# Altium project MB1075.PrjPCB
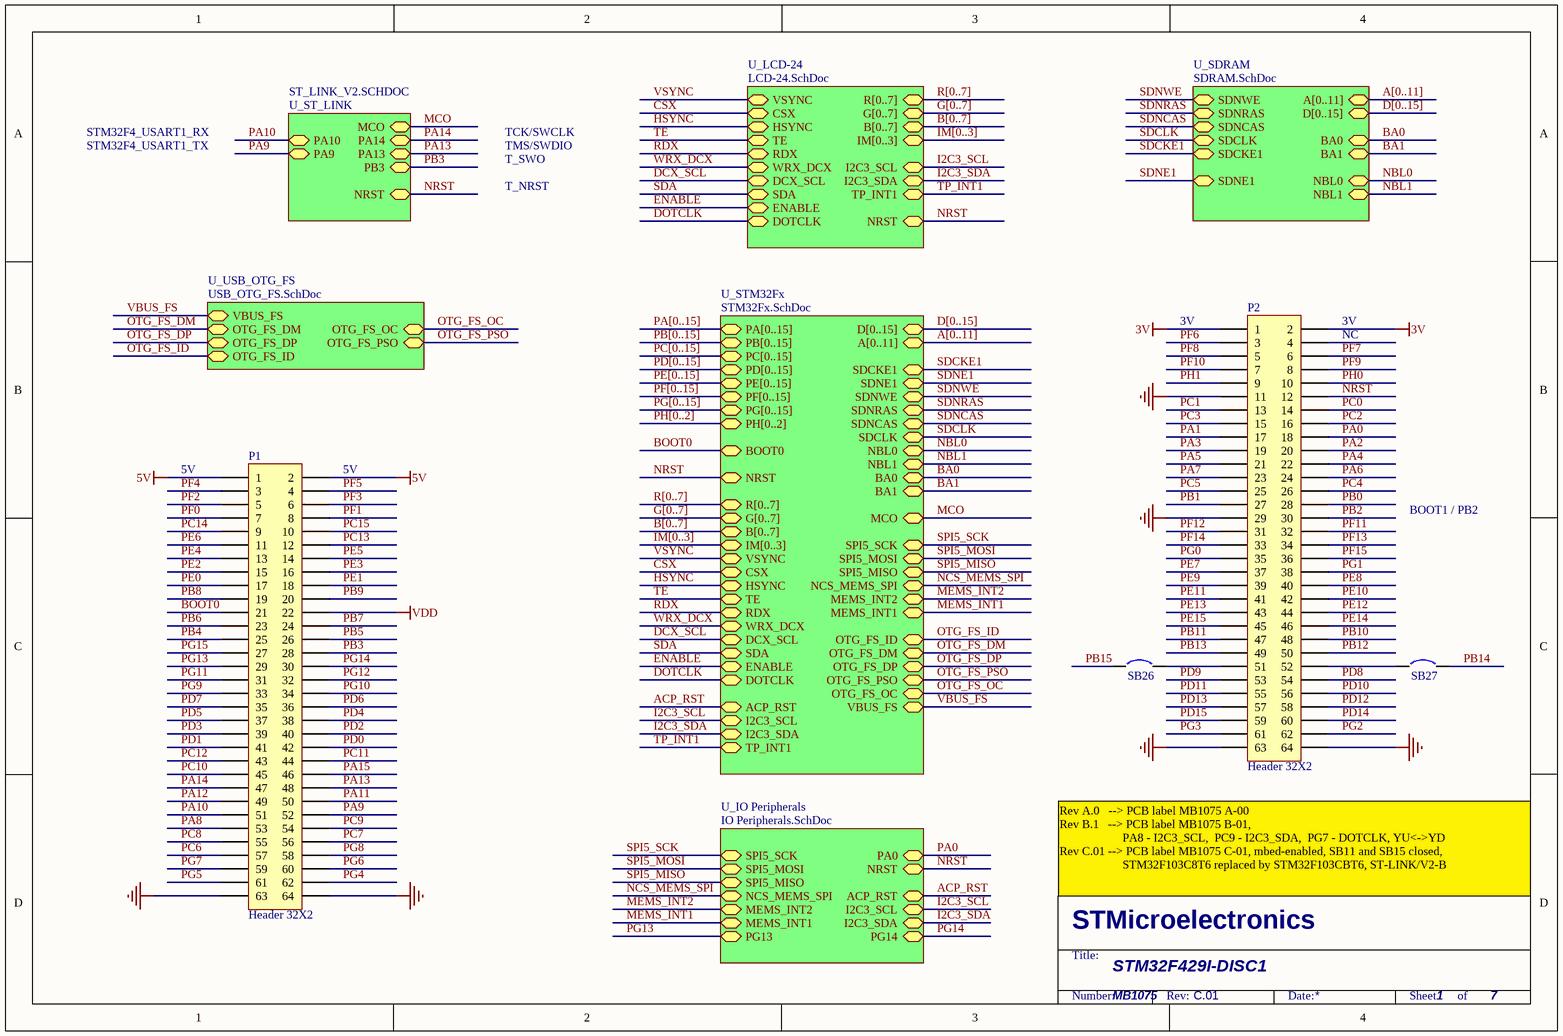
[diagram p0: MB1075.SchDoc]
6 sheets, 158 parts. Net scope: hierarchical (ports join the sheet entries above them; power ports are global).
Sheets:
  MB1075.SchDoc
    U_SDRAM = SDRAM.SchDoc
    U_IO Peripherals = IO Peripherals.SchDoc
    U_STM32Fx = STM32Fx.SchDoc
    U_USB_OTG_FS = USB_OTG_FS.SchDoc
    U_ST_LINK = ST_LINK_V2.SCHDOC

## Sheet MB1075.SchDoc
size A4; DocumentNumber: 1; Revision: C.01; SheetNumber: 1; SheetTotal: 7

### Parts
P1  Header 32X2  [HDR2X32]
P2  Header 32X2  [HDR2X32]
SB26  Circuit Breaker  [JP2_SMD]  (value not drawn)
SB27  Circuit Breaker  [JP2_SMD]  (value not drawn)

### Sub-sheets
U_IO Peripherals = IO Peripherals.SchDoc: PA0, NRST, MEMS_INT1, NCS_MEMS_SPI, MEMS_INT2, SPI5_SCK, SPI5_MISO, SPI5_MOSI, ACP_RST, I2C3_SCL, I2C3_SDA, PG13, PG14
U_LCD-24 = LCD-24.SchDoc (file not in this document): NRST, B[0..7], G[0..7], R[0..7], IM[0..3], TP_INT1, VSYNC, CSX, HSYNC, TE, WRX_DCX, RDX, ENABLE, DCX_SCL, SDA, I2C3_SCL, I2C3_SDA, DOTCLK
U_SDRAM = SDRAM.SchDoc: A[0..11], D[0..15], SDNE1, NBL1, NBL0, SDNWE, SDNRAS, SDNCAS, SDCLK, SDCKE1, BA0, BA1
U_ST_LINK = ST_LINK_V2.SCHDOC: PA13, PA14, NRST, PB3, MCO, PA10, PA9
U_STM32Fx = STM32Fx.SchDoc: BOOT0, NRST, MCO, D[0..15], A[0..11], SDCKE1, SDNE1, SDNWE, NBL0, SDNRAS, NBL1, SDCLK, SDNCAS, BA0, BA1, PA[0..15], PB[0..15], PC[0..15], PD[0..15], PE[0..15], PH[0..2], PF[0..15], PG[0..15], R[0..7], G[0..7], B[0..7], IM[0..3], TP_INT1, VSYNC, CSX, HSYNC, TE, WRX_DCX, RDX, ENABLE, DCX_SCL, SDA, I2C3_SCL, I2C3_SDA, ACP_RST, MEMS_INT1, NCS_MEMS_SPI, MEMS_INT2, SPI5_SCK, SPI5_MISO, SPI5_MOSI, OTG_FS_ID, OTG_FS_DM, OTG_FS_DP, OTG_FS_PSO, OTG_FS_OC, VBUS_FS, DOTCLK
U_USB_OTG_FS = USB_OTG_FS.SchDoc: OTG_FS_PSO, OTG_FS_OC, OTG_FS_DM, OTG_FS_DP, OTG_FS_ID, VBUS_FS

### Nets
3V: P2.1 P2.2
5V: P1.1 P1.2
GND: P1.63 P1.64 P2.11 P2.29 P2.63 P2.64
VDD: P1.22
ACP_RST: P2.23 ; sheet U_IO Peripherals/ACP_RST, sheet U_STM32Fx/ACP_RST  [also labelled PA7]
BA0: P1.62 ; sheet U_SDRAM/BA0, sheet U_STM32Fx/BA0  [also labelled PG4]
BA1: P1.61 ; sheet U_SDRAM/BA1, sheet U_STM32Fx/BA1  [also labelled PG5]
BOOT0: P1.21 ; sheet U_STM32Fx/BOOT0
CSX: P2.16 ; sheet U_STM32Fx/CSX, sheet U_LCD-24/CSX  [also labelled PC2]
DCX_SCL: P2.6 ; sheet U_IO Peripherals/SPI5_SCK, sheet U_STM32Fx/DCX_SCL, sheet U_STM32Fx/SPI5_SCK, sheet U_LCD-24/DCX_SCL  [also labelled PF7, SPI5_SCK]
DOTCLK: P1.59 ; sheet U_STM32Fx/DOTCLK, sheet U_LCD-24/DOTCLK  [also labelled PG7]
ENABLE: P2.7 ; sheet U_STM32Fx/ENABLE, sheet U_LCD-24/ENABLE  [also labelled PF10]
HSYNC: P1.57 ; sheet U_STM32Fx/HSYNC, sheet U_LCD-24/HSYNC  [also labelled PC6]
I2C3_SCL: P1.53 ; sheet U_IO Peripherals/I2C3_SCL, sheet U_STM32Fx/I2C3_SCL, sheet U_LCD-24/I2C3_SCL  [also labelled PA8]
I2C3_SDA: P1.54 ; sheet U_IO Peripherals/I2C3_SDA, sheet U_STM32Fx/I2C3_SDA, sheet U_LCD-24/I2C3_SDA  [also labelled PC9]
MCO: sheet U_STM32Fx/MCO, sheet U_ST_LINK/MCO
MEMS_INT1: P2.17 ; sheet U_IO Peripherals/MEMS_INT1, sheet U_STM32Fx/MEMS_INT1  [also labelled PA1]
MEMS_INT2: P2.20 ; sheet U_IO Peripherals/MEMS_INT2, sheet U_STM32Fx/MEMS_INT2  [also labelled PA2]
NBL0: P1.17 ; sheet U_SDRAM/NBL0, sheet U_STM32Fx/NBL0  [also labelled PE0]
NBL1: P1.18 ; sheet U_SDRAM/NBL1, sheet U_STM32Fx/NBL1  [also labelled PE1]
NCS_MEMS_SPI: P2.13 ; sheet U_IO Peripherals/NCS_MEMS_SPI, sheet U_STM32Fx/NCS_MEMS_SPI  [also labelled PC1]
NRST: P2.12 ; sheet U_IO Peripherals/NRST, sheet U_STM32Fx/NRST, sheet U_ST_LINK/NRST, sheet U_LCD-24/NRST
OTG_FS_DM: SB27.2 ; sheet U_STM32Fx/OTG_FS_DM, sheet U_USB_OTG_FS/OTG_FS_DM  [also labelled PB14]
OTG_FS_DP: SB26.1 ; sheet U_STM32Fx/OTG_FS_DP, sheet U_USB_OTG_FS/OTG_FS_DP  [also labelled PB15]
OTG_FS_ID: P2.50 ; sheet U_STM32Fx/OTG_FS_ID, sheet U_USB_OTG_FS/OTG_FS_ID  [also labelled PB12]
OTG_FS_OC: P2.25 ; sheet U_STM32Fx/OTG_FS_OC, sheet U_USB_OTG_FS/OTG_FS_OC  [also labelled PC5]
OTG_FS_PSO: P2.26 ; sheet U_STM32Fx/OTG_FS_PSO, sheet U_USB_OTG_FS/OTG_FS_PSO  [also labelled PC4]
PA0: P2.18 ; sheet U_IO Peripherals/PA0
PA3: P2.19  [project net B5]
PA4: P2.22 ; sheet U_STM32Fx/VSYNC, sheet U_LCD-24/VSYNC  [also labelled VSYNC]
PA5: P2.21
PA6: P2.24  [project net G2]
PA9: P1.52 ; sheet U_ST_LINK/PA9
PA10: P1.51 ; sheet U_ST_LINK/PA10
PA11: P1.50
PA12: P1.49
PA13: P1.48 ; sheet U_ST_LINK/PA13
PA14: P1.47 ; sheet U_ST_LINK/PA14
PA15: P1.46 ; sheet U_STM32Fx/TP_INT1, sheet U_LCD-24/TP_INT1  [also labelled TP_INT1]
PB0: P2.28
PB1: P2.27
PB2: P2.30
PB3: P1.28 ; sheet U_ST_LINK/PB3
PB4: P1.25
PB5: P1.26 ; sheet U_SDRAM/SDCKE1, sheet U_STM32Fx/SDCKE1  [also labelled SDCKE1]
PB6: P1.23 ; sheet U_SDRAM/SDNE1, sheet U_STM32Fx/SDNE1  [also labelled SDNE1]
PB7: P1.24
PB8: P1.19  [project net B6]
PB9: P1.20  [project net B7]
PB10: P2.48  [project net G4]
PB11: P2.47  [project net G5]
PB13: P2.49 ; sheet U_STM32Fx/VBUS_FS, sheet U_USB_OTG_FS/VBUS_FS  [also labelled VBUS_FS]
PC0: P2.14 ; sheet U_SDRAM/SDNWE, sheet U_STM32Fx/SDNWE  [also labelled SDNWE]
PC3: P2.15
PC7: P1.56  [project net G6]
PC8: P1.55
PC10: P1.45
PC11: P1.44
PC12: P1.43
PC13: P1.12
PC14: P1.9
PC15: P1.10
PD0: P1.42  [project net D2]
PD1: P1.41  [project net D3]
PD2: P1.40
PD3: P1.39  [project net G7]
PD4: P1.38
PD5: P1.37
PD6: P1.36  [project net B2]
PD7: P1.35
PD8: P2.54  [project net D13]
PD9: P2.53  [project net D14]
PD10: P2.56  [project net D15]
PD11: P2.55 ; sheet U_STM32Fx/TE, sheet U_LCD-24/TE  [also labelled TE]
PD12: P2.58 ; sheet U_STM32Fx/RDX, sheet U_LCD-24/RDX  [also labelled RDX]
PD13: P2.57 ; sheet U_STM32Fx/WRX_DCX, sheet U_LCD-24/WRX_DCX  [also labelled WRX_DCX]
PD14: P2.60  [project net D0]
PD15: P2.59  [project net D1]
PE2: P1.15
PE3: P1.16
PE4: P1.13
PE5: P1.14
PE6: P1.11
PE7: P2.37  [project net D4]
PE8: P2.40  [project net D5]
PE9: P2.39  [project net D6]
PE10: P2.42  [project net D7]
PE11: P2.41  [project net D8]
PE12: P2.44  [project net D9]
PE13: P2.43  [project net D10]
PE14: P2.46  [project net D11]
PE15: P2.45  [project net D12]
PF0: P1.7  [project net A0]
PF1: P1.8  [project net A1]
PF2: P1.5  [project net A2]
PF3: P1.6  [project net A3]
PF4: P1.3  [project net A4]
PF5: P1.4  [project net A5]
PF6: P2.3
PF8: P2.5 ; sheet U_IO Peripherals/SPI5_MISO, sheet U_STM32Fx/SPI5_MISO  [also labelled SPI5_MISO]
PF9: P2.8 ; sheet U_IO Peripherals/SPI5_MOSI, sheet U_STM32Fx/SDA, sheet U_STM32Fx/SPI5_MOSI, sheet U_LCD-24/SDA  [also labelled SDA, SPI5_MOSI]
PF11: P2.32 ; sheet U_SDRAM/SDNRAS, sheet U_STM32Fx/SDNRAS  [also labelled SDNRAS]
PF12: P2.31  [project net A6]
PF13: P2.34  [project net A7]
PF14: P2.33  [project net A8]
PF15: P2.36  [project net A9]
PG0: P2.35  [project net A10]
PG1: P2.38  [project net A11]
PG2: P2.62
PG3: P2.61
PG6: P1.60
PG8: P1.58 ; sheet U_SDRAM/SDCLK, sheet U_STM32Fx/SDCLK  [also labelled SDCLK]
PG9: P1.33
PG10: P1.34  [project net G3]
PG11: P1.31  [project net B3]
PG12: P1.32  [project net B4]
PG13: P1.29 ; sheet U_IO Peripherals/PG13
PG14: P1.30 ; sheet U_IO Peripherals/PG14
PG15: P1.27 ; sheet U_SDRAM/SDNCAS, sheet U_STM32Fx/SDNCAS  [also labelled SDNCAS]
PH0: P2.10
PH1: P2.9
NetP2_51: P2.51 SB26.2
NetP2_52: P2.52 SB27.1

Not connected (* = marked no-connect by the designer): P2 4

### Buses and harness runs
bus A[0..11] = sheet U_SDRAM/A[0..11]
bus A[0..11] = sheet U_STM32Fx/A[0..11]
bus B[0..7] = sheet U_LCD-24/B[0..7]
bus B[0..7] = sheet U_STM32Fx/B[0..7]
bus D[0..15] = sheet U_SDRAM/D[0..15]
bus D[0..15] = sheet U_STM32Fx/D[0..15]
bus G[0..7] = sheet U_LCD-24/G[0..7]
bus G[0..7] = sheet U_STM32Fx/G[0..7]
bus IM[0..3] = sheet U_LCD-24/IM[0..3]
bus IM[0..3] = sheet U_STM32Fx/IM[0..3]
bus PA[0..15] = sheet U_STM32Fx/PA[0..15]
bus PB[0..15] = sheet U_STM32Fx/PB[0..15]
bus PC[0..15] = sheet U_STM32Fx/PC[0..15]
bus PD[0..15] = sheet U_STM32Fx/PD[0..15]
bus PE[0..15] = sheet U_STM32Fx/PE[0..15]
bus PF[0..15] = sheet U_STM32Fx/PF[0..15]
bus PG[0..15] = sheet U_STM32Fx/PG[0..15]
bus PH[0..2] = sheet U_STM32Fx/PH[0..2]
bus R[0..7] = sheet U_LCD-24/R[0..7]
bus R[0..7] = sheet U_STM32Fx/R[0..7]

### Notes on the sheet
- STM32F4_USART1_TX
- STM32F4_USART1_RX
- TCK/SWCLK
- TMS/SWDIO
- T_SWO
- T_NRST
- 3V
- (near P2) NC
- (near P2) 3V
- 5V
- (near P1) 5V
- BOOT1 / PB2
- Rev A.0   --> PCB label MB1075 A-00
  Rev B.1   --> PCB label MB1075 B-01,
  PA8 - I2C3_SCL,  PC9 - I2C3_SDA,  PG7 - DOTCLK, YU<->YD
  Rev C.01 --> PCB label MB1075 C-01, mbed-enabled, SB11 and SB15 closed,
  STM32F103C8T6 replaced by STM32F103CBT6, ST-LINK/V2-B
- STM32F429I-DISC1
- MB1075
- STMicroelectronics
- Title:
- Number:
- Rev:
- Date:
- Sheet       of

### Library data of the parts
P1 P2 = Header 32X2: Header, 32-Pin, Dual row; LatestRevisionDate: 17-Jul-2002; LatestRevisionNote: Re-released for DXP Platform.; Publisher: Altium Limited
SB26 SB27 = Circuit Breaker: Solder: NO; Published: 24-Mar-1999; Revision: July-2002: Re-released for DXP Platform.; Publisher: Altium Limited

## Sheet SDRAM.SchDoc
size A4; DocumentNumber: 4; Revision: C.01; SheetNumber: 4; SheetTotal: 7
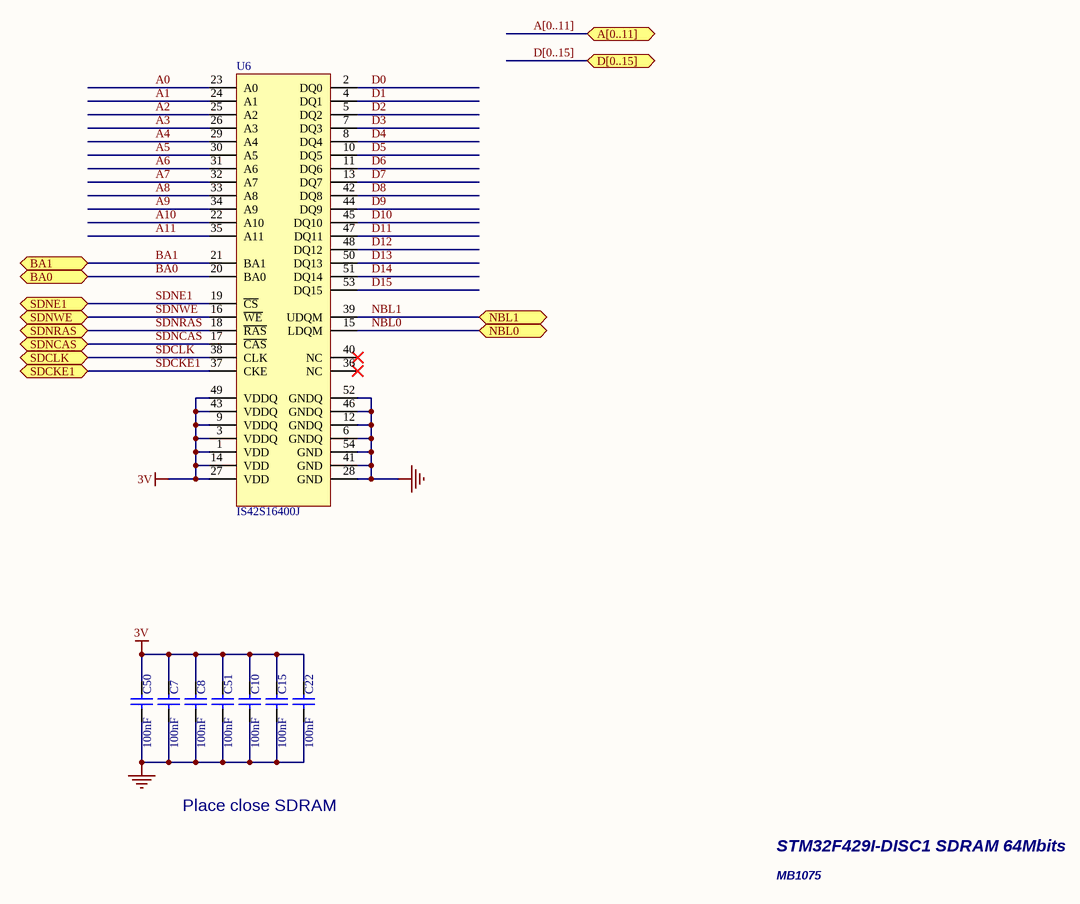
[diagram p1: SDRAM.SchDoc]

### Parts
C7  100nF  [0402C]
C8  100nF  [0402C]
C10  100nF  [0402C]
C15  100nF  [0402C]
C22  100nF  [0402C]
C50  100nF  [0402C]
C51  100nF  [0402C]
U6  IS42S16400J  [TSOP54-II]

### Ports
A[0..11], BA0, BA1, D[0..15], NBL0, NBL1, SDCKE1, SDCLK, SDNCAS, SDNE1, SDNRAS, SDNWE

### Nets
3V: C7.2 C8.2 C10.2 C15.2 C22.2 C50.2 C51.2 U6.1(VDD) U6.3(VDDQ) U6.9(VDDQ) U6.14(VDD) U6.27(VDD) U6.43(VDDQ) U6.49(VDDQ)
GND: C7.1 C8.1 C10.1 C15.1 C22.1 C50.1 C51.1 U6.6(GNDQ) U6.12(GNDQ) U6.28(GND) U6.41(GND) U6.46(GNDQ) U6.52(GNDQ) U6.54(GND)
A0: U6.23(A0)
A1: U6.24(A1)
A2: U6.25(A2)
A3: U6.26(A3)
A4: U6.29(A4)
A5: U6.30(A5)
A6: U6.31(A6)
A7: U6.32(A7)
A8: U6.33(A8)
A9: U6.34(A9)
A10: U6.22(A10)
A11: U6.35(A11)
BA0: U6.20(BA0) ; port BA0
BA1: U6.21(BA1) ; port BA1
D0: U6.2(DQ0)
D1: U6.4(DQ1)
D2: U6.5(DQ2)
D3: U6.7(DQ3)
D4: U6.8(DQ4)
D5: U6.10(DQ5)
D6: U6.11(DQ6)
D7: U6.13(DQ7)
D8: U6.42(DQ8)
D9: U6.44(DQ9)
D10: U6.45(DQ10)
D11: U6.47(DQ11)
D12: U6.48(DQ12)
D13: U6.50(DQ13)
D14: U6.51(DQ14)
D15: U6.53(DQ15)
NBL0: U6.15(LDQM) ; port NBL0
NBL1: U6.39(UDQM) ; port NBL1
SDCKE1: U6.37(CKE) ; port SDCKE1  [project net PB5]
SDCLK: U6.38(CLK) ; port SDCLK  [project net PG8]
SDNCAS: U6.17(~{CAS}) ; port SDNCAS  [project net PG15]
SDNE1: U6.19(~{CS}) ; port SDNE1  [project net PB6]
SDNRAS: U6.18(~{RAS}) ; port SDNRAS  [project net PF11]
SDNWE: U6.16(~{WE}) ; port SDNWE  [project net PC0]

Not connected (* = marked no-connect by the designer): U6 36(NC)* 40(NC)*

### Buses and harness runs
bus A[0..11] = port A[0..11]
bus D[0..15] = port D[0..15]

### Notes on the sheet
- Place close SDRAM
- STM32F429I-DISC1 SDRAM 64Mbits
- MB1075
- STMicroelectronics
- Title:
- Number:
- Rev:
- Date:
- Sheet       of

### Library data of the parts
C7 C8 C10 C15 C22 C50 C51 = Capacitor_ST: Capacitor 0402 / 0603 / 0805; Revision: July-2002: Re-released for DXP Platform.; Value: 100nF
U6 = IS45S16400J: SYNCHRONOUS DYNAMIC RAM, 1 Meg Bits x 16 Bits x 4 Banks (64-MBIT); Manuf_1: ISSI; Order: IS42S16400J-7TL; ECCN_US/EU: EAR99/NEC; Distrib: *; Manuf_Part_1: IS42S16400J-7TL; Ref St: *

## Sheet IO Peripherals.SchDoc
size A4; DocumentNumber: 6; Revision: C.01; SheetNumber: 6; SheetTotal: 7
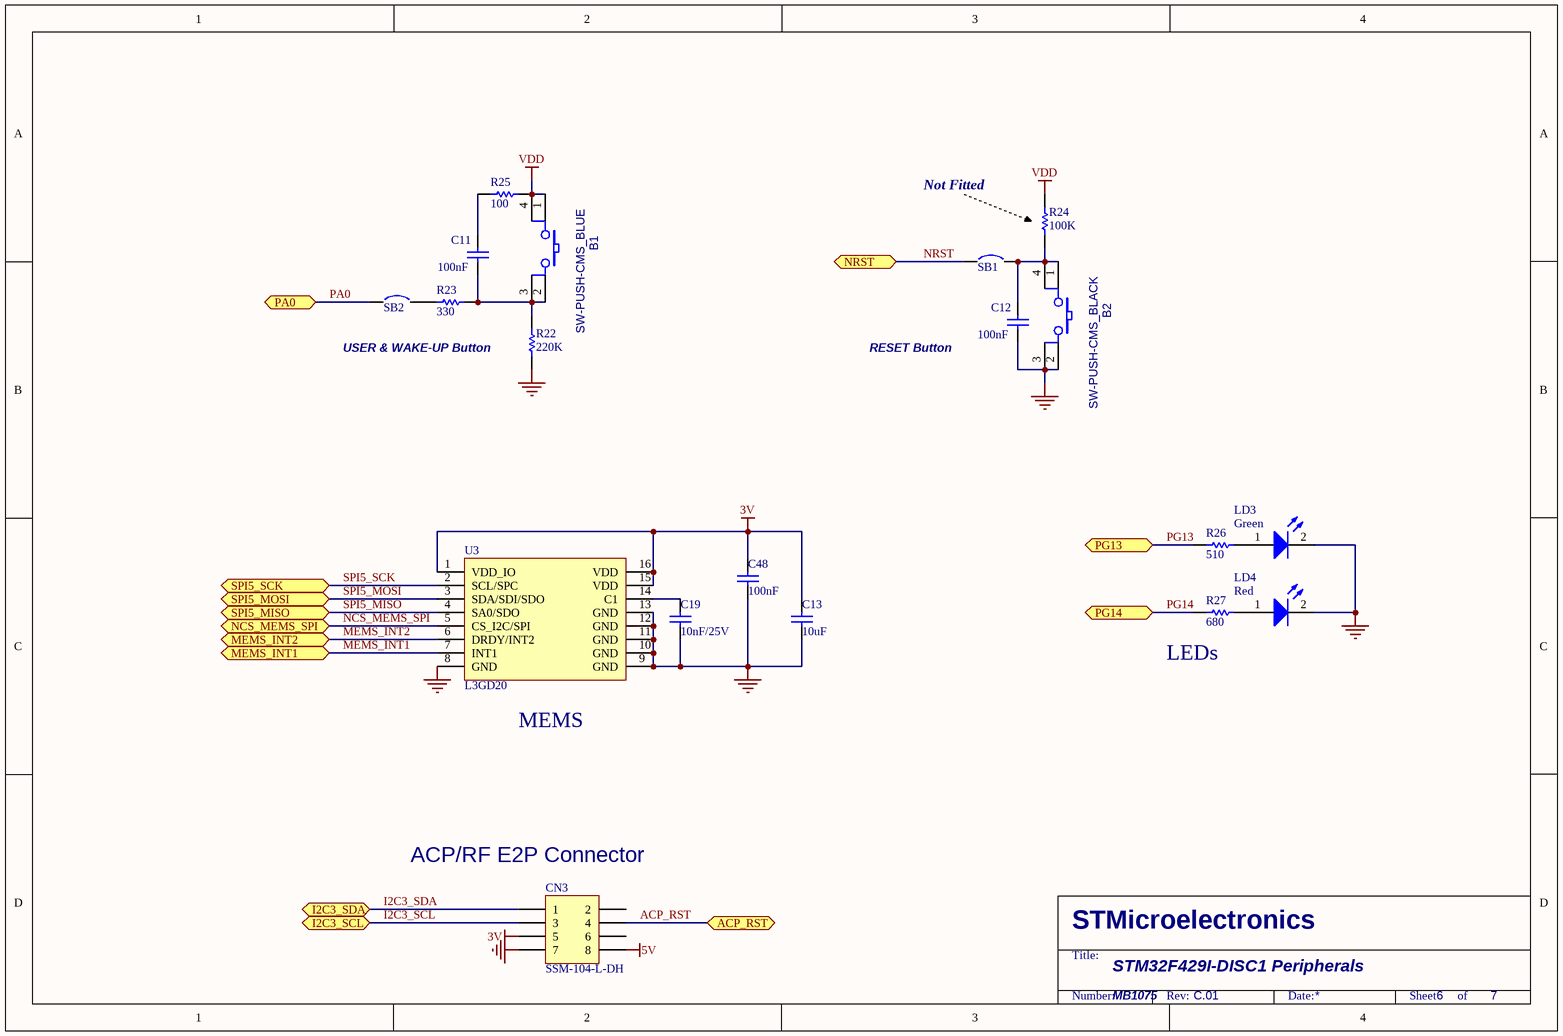
[diagram p2: IO Peripherals.SchDoc]

### Parts
B1  SW-PUSH-CMS_BLUE  [BP1CMS]
B2  SW-PUSH-CMS_BLACK  [BP1CMS]
C11  100nF  [0402C]
C12  100nF  [0402C]
C13  10uF  [0603C]
C19  10nF/25V  [0603C]
C48  100nF  [0402C]
CN3  SSM-104-L-DH  [SSM-104-L-DH]
LD3  Green  [0603D]
LD4  Red  [0603D]
R22  220K  [0402R]
R23  330  [0402R]
R24  100K  [0402R]
R25  100  [0402R]
R26  510  [0603R]
R27  680  [0603R]
SB1  Circuit Breaker  [JP2_SMD]  (value not drawn)
SB2  Circuit Breaker  [JP2_SMD]  (value not drawn)
U3  L3GD20  [LGA16-4x4]

### Ports
ACP_RST, I2C3_SCL, I2C3_SDA, MEMS_INT1, MEMS_INT2, NCS_MEMS_SPI, NRST, PA0, PG13, PG14, SPI5_MISO, SPI5_MOSI, SPI5_SCK

### Nets
3V: C13.2 C48.2 CN3.5 U3.1(VDD_IO) U3.15(VDD) U3.16(VDD)
5V: CN3.8
GND: B2.2 B2.3 C12.1 C13.1 C19.1 C48.1 CN3.7 LD3.2(K) LD4.2(K) R22.1 U3.8(GND) U3.9(GND) U3.10(GND) U3.11(GND) U3.12(GND) U3.13(GND)
VDD: B1.1 B1.4 R24.2 R25.2
ACP_RST: CN3.4 ; port ACP_RST
I2C3_SCL: CN3.3 ; port I2C3_SCL
I2C3_SDA: CN3.1 ; port I2C3_SDA
MEMS_INT1: U3.7(INT1) ; port MEMS_INT1
MEMS_INT2: U3.6(DRDY/INT2) ; port MEMS_INT2
NCS_MEMS_SPI: U3.5(CS_I2C/SPI) ; port NCS_MEMS_SPI
NRST: SB1.1 ; port NRST
PA0: SB2.1 ; port PA0
PG13: R26.1 ; port PG13
PG14: R27.1 ; port PG14
SPI5_MISO: U3.4(SA0/SDO) ; port SPI5_MISO  [project net PF8]
SPI5_MOSI: U3.3(SDA/SDI/SDO) ; port SPI5_MOSI  [project net PF9]
SPI5_SCK: U3.2(SCL/SPC) ; port SPI5_SCK  [project net DCX_SCL]
NetB1_2: B1.2 B1.3 C11.1 R22.2 R23.2
NetB2_1: B2.1 B2.4 C12.2 R24.1 SB1.2
NetC11_2: C11.2 R25.1
NetC19_2: C19.2 U3.14(C1)
NetLD3_1: LD3.1(A) R26.2
NetLD4_1: LD4.1(A) R27.2
NetR23_1: R23.1 SB2.2

Not connected (* = marked no-connect by the designer): CN3 2 6

### Notes on the sheet
- Not Fitted
- USER & WAKE-UP Button
- RESET Button
- (near R27) LEDs
- (near U3) MEMS
- (near CN3) ACP/RF E2P Connector
- STM32F429I-DISC1 Peripherals
- MB1075
- STMicroelectronics
- Title:
- Number:
- Rev:
- Date:
- Sheet       of

### Library data of the parts
B1 = SW-PUSH-CMS_BLUE: Non-Open Push-Button 0.1A 24V; Manuf_2: FARNELL; Manuf_Part_2: 535-930; Manuf_1: wealthmetal; Manuf_Part_1: TD0341X-G01-BLU; Ref St: 9180120; Description: Non-Open Push Button,Blue 0.1A 24V,Square head,6*6,SMT,180Degree,TD-0341X-GO1,wealthmetal; Distrib: *
B2 = SW-PUSH-CMS_BLACK: Non-Open Push-Button 0.1A 24V; Manuf_2: FARNELL; Manuf_Part_2: 535-930; Manuf_1: wealthmetal; Manuf_Part_1: TD0341X-G01-BLA; Ref St: 9180120; Description: Non-Open Push Button,Black 0.1A 24V,Square head,6*6,SMT,180Degree,TD-0341X-GO1,wealthmetal; Distrib: *
C11 C12 C48 = Capacitor_ST: Capacitor 0402 / 0603 / 0805; Revision: July-2002: Re-released for DXP Platform.; Value: 100nF
C13 C19 = CAP: Capacitor; Value: 100nF; Published: 8-Jun-2000; Revision: July-2002: Re-released for DXP Platform.; Publisher: Altium Limited
CN3 = SSM-104-L-DH: Header, 5-Pin, Dual row; Revision: 17-Jul-2002: Re-released for DXP Platform.; Publisher: Altium Limited
LD3 LD4 = LED2: Typical RED, GREEN, YELLOW, AMBER GaAs LED; Published: 8-Jun-2000; Revision: July-2002: Re-released for DXP Platform.; Publisher: Altium Limited
R22-R27 = Resistor_ST: Resistor 0402 / 0603 / 0805; Description: Resistor 0402 or 0603 or 0805; Value: 10K
SB1 SB2 = Circuit Breaker: Solder: YES; Published: 24-Mar-1999; Revision: July-2002: Re-released for DXP Platform.; Publisher: Altium Limited
U3 = L3GD20: MEMS motion sensor three-axis digital output gyroscopeelerometer; Manuf_1: STM; Manuf_Part_1: L3GD20TR; Provided: ST; Ref St: 9177042; ECCN_US/EU: EAR99/NEC; Distrib: ST; Footprint: LGA16(4*4); Order: L3GD20TR

## Sheet STM32Fx.SchDoc
size A4; DocumentNumber: 5; Revision: C.01; SheetNumber: 5; SheetTotal: 7
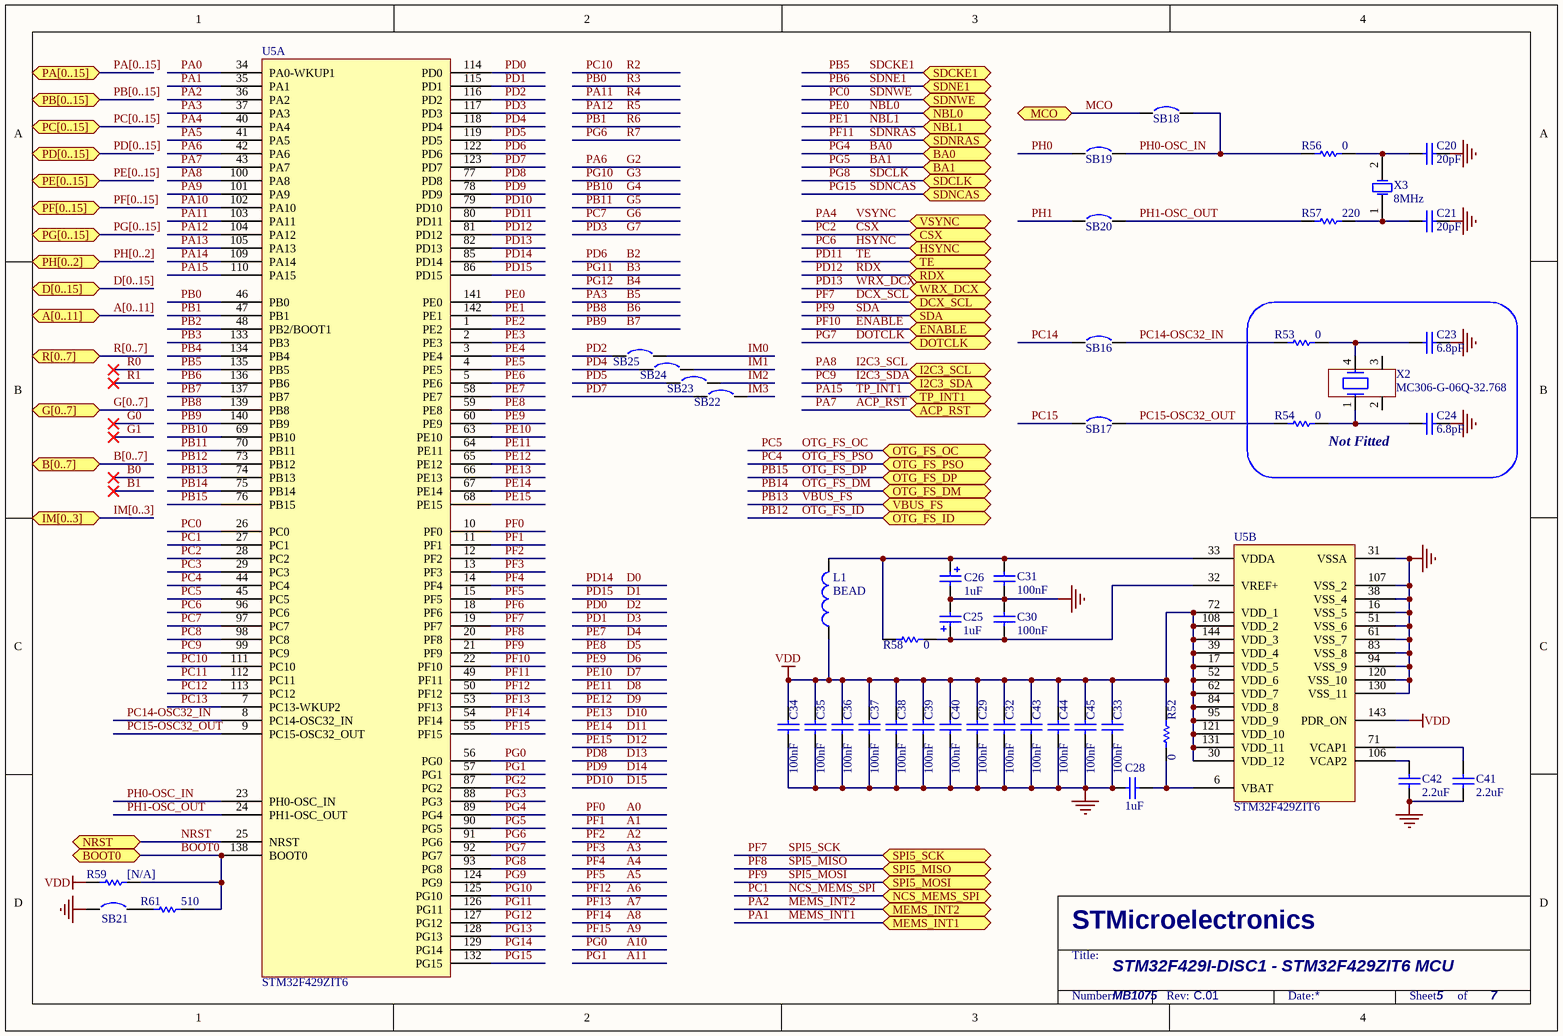
[diagram p3: STM32Fx.SchDoc]

### Parts
C20  20pF  [0402C]
C21  20pF  [0402C]
C23  6.8pF  [0402C]
C24  6.8pF  [0402C]
C25  1uF  [TAN-A]
C26  1uF  [TAN-A]
C28  1uF  [0603C]
C29  100nF  [0402C]
C30  100nF  [0402C]
C31  100nF  [0402C]
C32  100nF  [0402C]
C33  100nF  [0402C]
C34  100nF  [0402C]
C35  100nF  [0402C]
C36  100nF  [0402C]
C37  100nF  [0402C]
C38  100nF  [0402C]
C39  100nF  [0402C]
C40  100nF  [0402C]
C41  2.2uF  [TAN-A]
C42  2.2uF  [TAN-A]
C43  100nF  [0402C]
C44  100nF  [0402C]
C45  100nF  [0402C]
L1  BEAD  [0603L]
R52  0  [0402R]
R53  0  [0402R]
R54  0  [0402R]
R56  0  [0402R]
R57  220  [0402R]
R58  0  [0402R]
R59  [N/A]  [0402R]
R61  510  [0402R]
SB16  Circuit Breaker  [JP2_SMD]  (value not drawn)
SB17  Circuit Breaker  [JP2_SMD]  (value not drawn)
SB18  Circuit Breaker  [JP2_SMD]  (value not drawn)
SB19  Circuit Breaker  [JP2_SMD]  (value not drawn)
SB20  Circuit Breaker  [JP2_SMD]  (value not drawn)
SB21  Circuit Breaker  [JP2_SMD]  (value not drawn)
SB22  Circuit Breaker  [JP2_SMD]  (value not drawn)
SB23  Circuit Breaker  [JP2_SMD]  (value not drawn)
SB24  Circuit Breaker  [JP2_SMD]  (value not drawn)
SB25  Circuit Breaker  [JP2_SMD]  (value not drawn)
U5  STM32F429ZIT6  [TQFP144]  (parts A,B of 2)
X2  MC306-G-06Q-32.768  [MC306-CRYSTAL]
X3  8MHz  [XTAL1]

### Blocks framed on the sheet
Not Fitted: C23 C24 R53 R54 X2

### Ports
A[0..11], ACP_RST, B[0..7], BA0, BA1, BOOT0, CSX, D[0..15], DCX_SCL, DOTCLK, ENABLE, G[0..7], HSYNC, I2C3_SCL, I2C3_SDA, IM[0..3], MCO, MEMS_INT1, MEMS_INT2, NBL0, NBL1, NCS_MEMS_SPI, NRST, OTG_FS_DM, OTG_FS_DP, OTG_FS_ID, OTG_FS_OC, OTG_FS_PSO, PA[0..15], PB[0..15], PC[0..15], PD[0..15], PE[0..15], PF[0..15], PG[0..15], PH[0..2], R[0..7], RDX, SDA, SDCKE1, SDCLK, SDNCAS, SDNE1, SDNRAS, SDNWE, SPI5_MISO, SPI5_MOSI, SPI5_SCK, TE, TP_INT1, VBUS_FS, VSYNC, WRX_DCX

### Nets
GND: C20.2 C21.2 C23.2 C24.2 C25.2 C26.2 C28.1 C29.1 C30.2 C31.1 C32.1 C33.1 C34.1 C35.1 C36.1 C37.1 C38.1 C39.1 C40.1 C41.2 C42.2 C43.1 C44.1 C45.1 SB21.1 U5.16(VSS_5) U5.31(VSSA) U5.38(VSS_4) U5.51(VSS_6) U5.61(VSS_7) U5.83(VSS_8) U5.94(VSS_9) U5.107(VSS_2) U5.120(VSS_10) U5.130(VSS_11)
VDD: C29.2 C32.2 C33.2 C34.2 C35.2 C36.2 C37.2 C38.2 C39.2 C40.2 C43.2 C44.2 C45.2 L1.1 R52.2 R59.1 U5.17(VDD_5) U5.30(VDD_12) U5.39(VDD_4) U5.52(VDD_6) U5.62(VDD_7) U5.72(VDD_1) U5.84(VDD_8) U5.95(VDD_9) U5.108(VDD_2) U5.121(VDD_10) U5.131(VDD_11) U5.143(PDR_ON) U5.144(VDD_3)
A0: U5.10(PF0)  [also labelled PF0]
A1: U5.11(PF1)  [also labelled PF1]
A2: U5.12(PF2)  [also labelled PF2]
A3: U5.13(PF3)  [also labelled PF3]
A4: U5.14(PF4)  [also labelled PF4]
A5: U5.15(PF5)  [also labelled PF5]
A6: U5.50(PF12)  [also labelled PF12]
A7: U5.53(PF13)  [also labelled PF13]
A8: U5.54(PF14)  [also labelled PF14]
A9: U5.55(PF15)  [also labelled PF15]
A10: U5.56(PG0)  [also labelled PG0]
A11: U5.57(PG1)  [also labelled PG1]
ACP_RST: U5.43(PA7) ; port ACP_RST  [also labelled PA7]
B2: U5.122(PD6)  [also labelled PD6]
B3: U5.126(PG11)  [also labelled PG11]
B4: U5.127(PG12)  [also labelled PG12]
B5: U5.37(PA3)  [also labelled PA3]
B6: U5.139(PB8)  [also labelled PB8]
B7: U5.140(PB9)  [also labelled PB9]
BA0: U5.89(PG4) ; port BA0  [also labelled PG4]
BA1: U5.90(PG5) ; port BA1  [also labelled PG5]
BOOT0: R59.2 R61.2 U5.138(BOOT0) ; port BOOT0
CSX: U5.28(PC2) ; port CSX  [also labelled PC2]
D0: U5.85(PD14)  [also labelled PD14]
D1: U5.86(PD15)  [also labelled PD15]
D2: U5.114(PD0)  [also labelled PD0]
D3: U5.115(PD1)  [also labelled PD1]
D4: U5.58(PE7)  [also labelled PE7]
D5: U5.59(PE8)  [also labelled PE8]
D6: U5.60(PE9)  [also labelled PE9]
D7: U5.63(PE10)  [also labelled PE10]
D8: U5.64(PE11)  [also labelled PE11]
D9: U5.65(PE12)  [also labelled PE12]
D10: U5.66(PE13)  [also labelled PE13]
D11: U5.67(PE14)  [also labelled PE14]
D12: U5.68(PE15)  [also labelled PE15]
D13: U5.77(PD8)  [also labelled PD8]
D14: U5.78(PD9)  [also labelled PD9]
D15: U5.79(PD10)  [also labelled PD10]
DCX_SCL: U5.19(PF7) ; port DCX_SCL, port SPI5_SCK  [also labelled PF7, SPI5_SCK]
DOTCLK: U5.92(PG7) ; port DOTCLK  [also labelled PG7]
ENABLE: U5.22(PF10) ; port ENABLE  [also labelled PF10]
G2: U5.42(PA6)  [also labelled PA6]
G3: U5.125(PG10)  [also labelled PG10]
G4: U5.69(PB10)  [also labelled PB10]
G5: U5.70(PB11)  [also labelled PB11]
G6: U5.97(PC7)  [also labelled PC7]
G7: U5.117(PD3)  [also labelled PD3]
HSYNC: U5.96(PC6) ; port HSYNC  [also labelled PC6]
I2C3_SCL: U5.100(PA8) ; port I2C3_SCL  [also labelled PA8]
I2C3_SDA: U5.99(PC9) ; port I2C3_SDA  [also labelled PC9]
IM0: SB25.2
IM1: SB24.2
IM2: SB23.2
IM3: SB22.2
MCO: SB18.1 ; port MCO
MEMS_INT1: U5.35(PA1) ; port MEMS_INT1  [also labelled PA1]
MEMS_INT2: U5.36(PA2) ; port MEMS_INT2  [also labelled PA2]
NBL0: U5.141(PE0) ; port NBL0  [also labelled PE0]
NBL1: U5.142(PE1) ; port NBL1  [also labelled PE1]
NCS_MEMS_SPI: U5.27(PC1) ; port NCS_MEMS_SPI  [also labelled PC1]
NRST: U5.25(NRST) ; port NRST
OTG_FS_DM: U5.75(PB14) ; port OTG_FS_DM  [also labelled PB14]
OTG_FS_DP: U5.76(PB15) ; port OTG_FS_DP  [also labelled PB15]
OTG_FS_ID: U5.73(PB12) ; port OTG_FS_ID  [also labelled PB12]
OTG_FS_OC: U5.45(PC5) ; port OTG_FS_OC  [also labelled PC5]
OTG_FS_PSO: U5.44(PC4) ; port OTG_FS_PSO  [also labelled PC4]
PA0: U5.34(PA0-WKUP1)
PA4: U5.40(PA4) ; port VSYNC  [also labelled VSYNC]
PA5: U5.41(PA5)
PA9: U5.101(PA9)
PA10: U5.102(PA10)
PA11: U5.103(PA11)  [also labelled R4]
PA12: U5.104(PA12)  [also labelled R5]
PA13: U5.105(PA13)
PA14: U5.109(PA14)
PA15: U5.110(PA15) ; port TP_INT1  [also labelled TP_INT1]
PB0: U5.46(PB0)  [also labelled R3]
PB1: U5.47(PB1)  [also labelled R6]
PB2: U5.48(PB2/BOOT1)
PB3: U5.133(PB3)
PB4: U5.134(PB4)
PB5: U5.135(PB5) ; port SDCKE1  [also labelled SDCKE1]
PB6: U5.136(PB6) ; port SDNE1  [also labelled SDNE1]
PB7: U5.137(PB7)
PB13: U5.74(PB13) ; port VBUS_FS  [also labelled VBUS_FS]
PC0: U5.26(PC0) ; port SDNWE  [also labelled SDNWE]
PC3: U5.29(PC3)
PC8: U5.98(PC8)
PC10: U5.111(PC10)  [also labelled R2]
PC11: U5.112(PC11)
PC12: U5.113(PC12)
PC13: U5.7(PC13-WKUP2)
PC14: SB16.1
PC14-OSC32_IN: R53.1 SB16.2 U5.8(PC14-OSC32_IN)
PC15: SB17.1
PC15-OSC32_OUT: R54.1 SB17.2 U5.9(PC15-OSC32_OUT)
PD2: SB25.1 U5.116(PD2)
PD4: SB24.1 U5.118(PD4)
PD5: SB23.1 U5.119(PD5)
PD7: SB22.1 U5.123(PD7)
PD11: U5.80(PD11) ; port TE  [also labelled TE]
PD12: U5.81(PD12) ; port RDX  [also labelled RDX]
PD13: U5.82(PD13) ; port WRX_DCX  [also labelled WRX_DCX]
PE2: U5.1(PE2)
PE3: U5.2(PE3)
PE4: U5.3(PE4)
PE5: U5.4(PE5)
PE6: U5.5(PE6)
PF6: U5.18(PF6)
PF8: U5.20(PF8) ; port SPI5_MISO  [also labelled SPI5_MISO]
PF9: U5.21(PF9) ; port SDA, port SPI5_MOSI  [also labelled SDA, SPI5_MOSI]
PF11: U5.49(PF11) ; port SDNRAS  [also labelled SDNRAS]
PG2: U5.87(PG2)
PG3: U5.88(PG3)
PG6: U5.91(PG6)  [also labelled R7]
PG8: U5.93(PG8) ; port SDCLK  [also labelled SDCLK]
PG9: U5.124(PG9)
PG13: U5.128(PG13)
PG14: U5.129(PG14)
PG15: U5.132(PG15) ; port SDNCAS  [also labelled SDNCAS]
PH0: SB19.1
PH0-OSC_IN: R56.1 SB18.2 SB19.2 U5.23(PH0-OSC_IN)
PH1: SB20.1
PH1-OSC_OUT: R57.1 SB20.2 U5.24(PH1-OSC_OUT)
NetC20_1: C20.1 R56.2 X3.2(OSC2)
NetC21_1: C21.1 R57.2 X3.1(OSC1)
NetC23_1: C23.1 R53.2 X2.4
NetC24_1: C24.1 R54.2 X2.1
NetC25_1: C25.1 C30.1 R58.2 U5.32(VREF+)
NetC26_1: C26.1 C31.2 L1.2 R58.1 U5.33(VDDA)
NetC28_2: C28.2 R52.1 U5.6(VBAT)
NetC41_1: C41.1 U5.71(VCAP1)
NetC42_1: C42.1 U5.106(VCAP2)
NetR61_1: R61.1 SB21.2

Not connected (* = marked no-connect by the designer): X2 2 3

### Buses and harness runs
bus A[0..11] = port A[0..11]
bus B[0..7] = port B[0..7]
bus D[0..15] = port D[0..15]
bus G[0..7] = port G[0..7]
bus IM[0..3] = port IM[0..3]
bus PA[0..15] = port PA[0..15]
bus PB[0..15] = port PB[0..15]
bus PC[0..15] = port PC[0..15]
bus PD[0..15] = port PD[0..15]
bus PE[0..15] = port PE[0..15]
bus PF[0..15] = port PF[0..15]
bus PG[0..15] = port PG[0..15]
bus PH[0..2] = port PH[0..2]
bus R[0..7] = port R[0..7]

### Notes on the sheet
- STM32F429I-DISC1 - STM32F429ZIT6 MCU
- MB1075
- STMicroelectronics
- Title:
- Number:
- Rev:
- Date:
- Sheet       of

### Library data of the parts
C20 C21 C28 = Capacitor_ST: Capacitor 0402 / 0603 / 0805; Value: 100nF; Revision: July-2002: Re-released for DXP Platform.
C23 C24 = Capacitor_ST: Capacitor 0402 / 0603 / 0805; Value: 100nF; Fitted: NO; Revision: July-2002: Re-released for DXP Platform.
C25 C26 = Cap Pol1: Polarized Capacitor (Radial); Value: 10uF; Published: 8-Jun-2000; Revision: July-2002: Re-released for DXP Platform.; Publisher: Altium Limited
C29-C40 C43-C45 = Capacitor_ST: Capacitor 0402 / 0603 / 0805; Revision: July-2002: Re-released for DXP Platform.; Value: 100nF
C41 C42 = Cap Low ESR: Low ESR Ceramic Capacitor (X7R); Order: CC1206KKX7R7BB225; Revision: July-2002: Re-released for DXP Platform.; Value: 2.2uF; Distrib: FARNELL; Manuf_Part_1: CC1206KKX7R7BB225; Manuf_1: www.yageo.com
L1 = Inductor: Manuf_Part_1: FCM1608KF-601T03; Value: 100uH; Published: 8-Jun-2000; Revision: July-2002: Re-released for DXP Platform.; Publisher: Altium Limited; Order: FCM1608KF-601T03
R52 R56-R58 R61 = Resistor_ST: as R22 on sheet IO Peripherals
R53 R54 R59 = Resistor_ST: Resistor 0402 / 0603 / 0805; Description: Resistor 0402 or 0603 or 0805; Value: 10K; Fitted: NO
SB16-SB18 SB20 SB21 = Circuit Breaker: Solder: YES; Published: 24-Mar-1999; Revision: July-2002: Re-released for DXP Platform.; Publisher: Altium Limited
SB19 SB22-SB25 = Circuit Breaker: Solder: NO; Published: 24-Mar-1999; Revision: July-2002: Re-released for DXP Platform.; Publisher: Altium Limited
U5 = STM32F429ZIT6U: STM32 Big Manta (STM32F429ZIT6U); Manuf_1: STM; Provided: ST; Ref St: 9175122; ECCN_US/EU: 3A991A2/NEC; Distrib: ST; Footprint: QFP144; Order: STM32F429ZIT6U; Manuf_Part_1: STM32F429ZIT6U
X2 = XTAL_32K: Crystal oscillator for clock,32.768K,6PF,20PPM,-40~85 degree,SMT; Manuf_Part_1: ETMB32.768W060BMPF; Manuf_1: JFVNY; Description: crystal oscillator for clock,32.768K,6PF,20PPM,-40~85 degree,SMT,ETMB32.768W060BMPF; Fitted: NO
X3 = XTAL: Crystal Oscillator,8Mhz,20PF,20PPM,-10-70 degree,DIP,HC-49S; Manuf_Part_1: 9SL8000020AFXHF0; Order: 9SL8000020AFXHF0

## Sheet USB_OTG_FS.SchDoc
size A4; DocumentNumber: 3; Revision: C.01; SheetNumber: 3; SheetTotal: 7
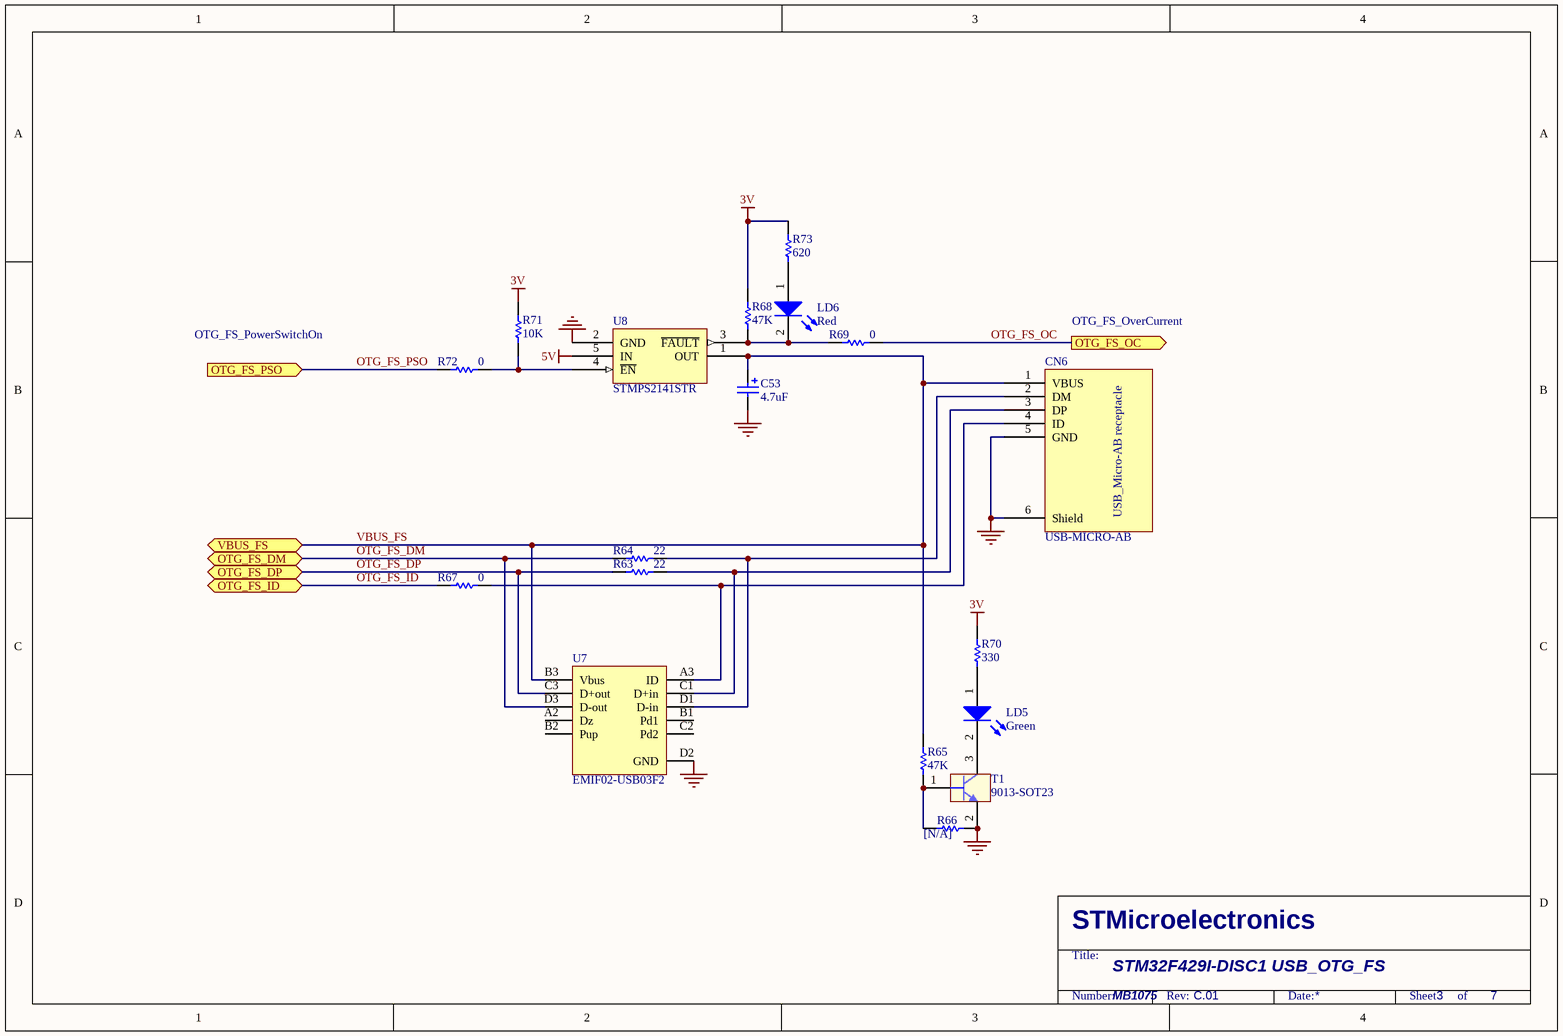
[diagram p4: USB_OTG_FS.SchDoc]

### Parts
C53  4.7uF  [TAN-A]
CN6  USB-MICRO-AB  [USB-MICRO-AB]
LD5  Green  [0603D]
LD6  Red  [0603D]
R63  22  [0402R]
R64  22  [0402R]
R65  47K  [0402R]
R66  [N/A]  [0402R]
R67  0  [0402R]
R68  47K  [0402R]
R69  0  [0402R]
R70  330  [0603R]
R71  10K  [0402R]
R72  0  [0402R]
R73  620  [0603R]
T1  9013-SOT23  [SOT-23]
U7  EMIF02-USB03F2  [Flip Chip]
U8  STMPS2141STR  [SOT23-5L]

### Ports
OTG_FS_DM, OTG_FS_DP, OTG_FS_ID, OTG_FS_OC, OTG_FS_PSO, VBUS_FS

### Nets
3V: R68.2 R70.2 R71.2 R73.2
5V: U8.5(IN)
GND: C53.2 CN6.5(GND) CN6.6(Shield) R66.2 T1.2(E) U7.D2(GND) U8.2(GND)
OTG_FS_DM: R64.1 U7.D3(D-out) ; port OTG_FS_DM
OTG_FS_DP: R63.1 U7.C3(D+out) ; port OTG_FS_DP
OTG_FS_ID: R67.1 ; port OTG_FS_ID
OTG_FS_OC: R69.2 ; port OTG_FS_OC
OTG_FS_PSO: R72.1 ; port OTG_FS_PSO
VBUS_FS: C53.1 CN6.1(VBUS) R65.2 U7.B3(Vbus) U8.1(OUT) ; port VBUS_FS  [project net PB13]
NetCN6_2: CN6.2(DM) R64.2 U7.D1(D-in)
NetCN6_3: CN6.3(DP) R63.2 U7.C1(D+in)
NetCN6_4: CN6.4(ID) R67.2 U7.A3(ID)
NetLD5_1: LD5.1(A) R70.1
NetLD5_2: LD5.2(K) T1.3(C)
NetLD6_1: LD6.1(A) R73.1
NetLD6_2: LD6.2(K) R68.1 R69.1 U8.3(~{FAULT})
NetR65_1: R65.1 R66.1 T1.1(B)
NetR71_1: R71.1 R72.2 U8.4(~{EN})

Not connected (* = marked no-connect by the designer): U7 A2(Dz) B1(Pd1) B2(Pup) C2(Pd2)

### Notes on the sheet
- OTG_FS_PowerSwitchOn
- OTG_FS_OverCurrent
- STM32F429I-DISC1 USB_OTG_FS
- MB1075
- STMicroelectronics
- Title:
- Number:
- Rev:
- Date:
- Sheet       of
- (in symbol USB-MICRO-AB) USB_Micro-AB receptacle

### Library data of the parts
C53 = Cap Pol1: Polarized Capacitor (Radial); Value: 47uF; Published: 8-Jun-2000; Revision: July-2002: Re-released for DXP Platform.; Publisher: Altium Limited
CN6 = USB-MICRO-AB: USB-MICRO-AB, 47590-0001, SMT, MOLEX; Ref St: xxxxxxx; Manuf_1: MOLEX; Manuf_Part_1: 47590-0001; ECCN_US/EU: *; Distrib: *
LD5 LD6 = LED2: as LD3 on sheet IO Peripherals; Published: 8-Jun-2000; Revision: July-2002: Re-released for DXP Platform.; Publisher: Altium Limited
R63-R65 R67-R70 R72 R73 = Resistor_ST: as R22 on sheet IO Peripherals
R66 = Resistor_ST: as R53 on sheet STM32Fx
R71 = Resistor_ST: Resistor 0402 / 0603 / 0805; Description: Resistor 0402 or 0603 or 0805; Value: 10K
T1 = 9013-SOT23: NPN Bipolar Transistor; Description: NPN Bipolar Transistor, SOT-23 Footprint; Revision: July-2002: Re-released for DXP Platform.
U7 = EMIF02-USB03F2: 2-line IPAD, EMI filter including ESD protection; Manuf_1: STM; Provided: ST; ECCN_US/EU: EAR99/NEC; Ref St: 9179037; Order: EMIF02-USB03F2; Manuf_Part_1: EMIF02-USB03F2; Distrib: ST
U8 = STMPS2141STR: Enhanced single channel power switches; Manuf_1: STM; Provided: ST; ECCN_US/EU: EAR99/NEC; Order: STMPS2141STR; Manuf_Part_1: STMPS2141STR; Distrib: ST

## Sheet ST_LINK_V2.SCHDOC
size A4; DocumentNumber: 2; Revision: C.01; SheetNumber: 2; SheetTotal: 7
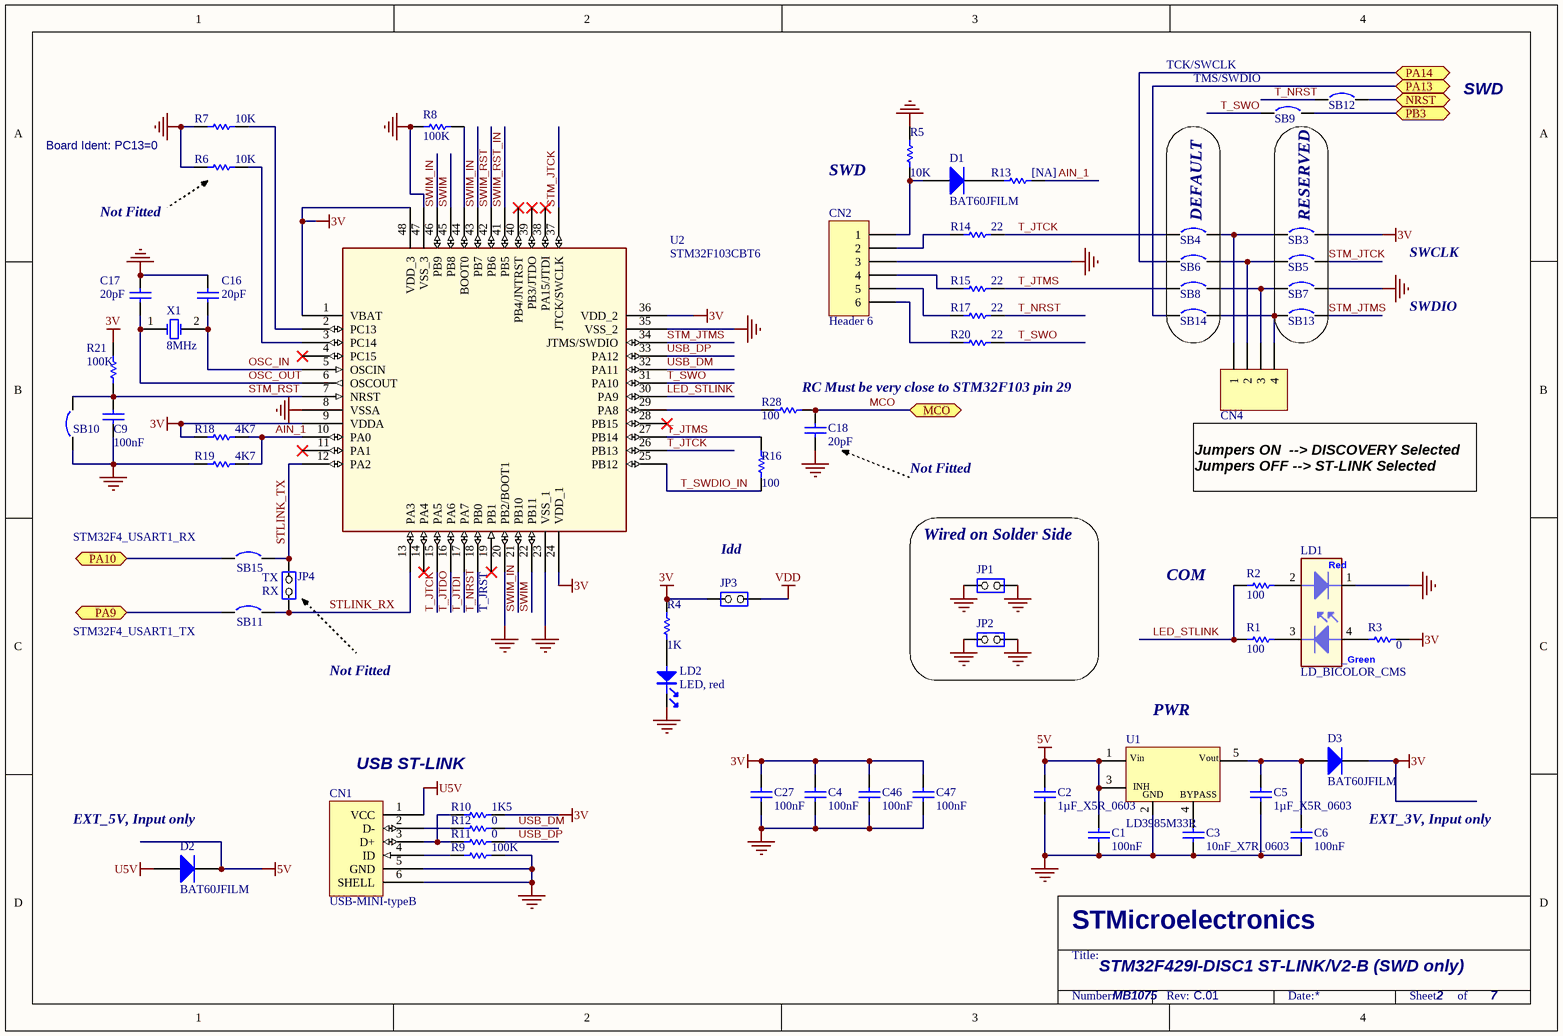
[diagram p5: ST_LINK_V2.SCHDOC]

### Parts
C1  100nF  [0402C]
C2  1µF_X5R_0603  [0603C]
C3  10nF_X7R_0603  [0603C]
C4  100nF  [0402C]
C5  1µF_X5R_0603  [0603C]
C6  100nF  [0402C]
C9  100nF  [0402C]
C16  20pF  [0402C]
C17  20pF  [0402C]
C18  20pF  [0402C]
C27  100nF  [0402C]
C46  100nF  [0402C]
C47  100nF  [0402C]
CN1  USB-MINI-typeB  [USB-MINI-B-SMD]
CN2  Header 6  [HDR1X6]
CN4  Header 4  [Header 4]  (value not drawn)
D1  BAT60JFILM  [SOD323/A]
D2  BAT60JFILM  [SOD323/A]
D3  BAT60JFILM  [SOD323/A]
JP1  (no value)  [SIP2/2.54]
JP2  (no value)  [SIP2/2.54]
JP3  (no value)  [SIP2/2.54]
JP4  JP2  [SIP2/2.54]  (value not drawn)
LD1  LD_BICOLOR_CMS  [HSMF-A201]
LD2  LED, red  [0603D]
R1  100  [0402R]
R2  100  [0402R]
R3  0  [0402R]
R4  1K  [0402R]
R5  10K  [0402R]
R6  10K  [0402R]
R7  10K  [0402R]
R8  100K  [0402R]
R9  100K  [0402R]
R10  1K5  [0402R]
R11  0  [0402R]
R12  0  [0402R]
R13  [NA]  [0402R]
R14  22  [0402R]
R15  22  [0402R]
R16  100  [0402R]
R17  22  [0402R]
R18  4K7  [0402R]
R19  4K7  [0402R]
R20  22  [0402R]
R21  100K  [0402R]
R28  100  [0402R]
SB3  Circuit Breaker  [JP2_SMD]  (value not drawn)
SB4  Circuit Breaker  [JP2_SMD]  (value not drawn)
SB5  Circuit Breaker  [JP2_SMD]  (value not drawn)
SB6  Circuit Breaker  [JP2_SMD]  (value not drawn)
SB7  Circuit Breaker  [JP2_SMD]  (value not drawn)
SB8  Circuit Breaker  [JP2_SMD]  (value not drawn)
SB9  Circuit Breaker  [JP2_SMD]  (value not drawn)
SB10  Circuit Breaker  [JP2_SMD]  (value not drawn)
SB11  Circuit Breaker  [JP2_SMD]  (value not drawn)
SB12  Circuit Breaker  [JP2_SMD]  (value not drawn)
SB13  Circuit Breaker  [JP2_SMD]  (value not drawn)
SB14  Circuit Breaker  [JP2_SMD]  (value not drawn)
SB15  Circuit Breaker  [JP2_SMD]  (value not drawn)
U1  LD3985M33R  [SOT-23-5L]
U2  STM32F103CBT6  [QFP48 7x7]
X1  8MHz  [XTAL1]

### Blocks framed on the sheet
DEFAULT: SB4 SB6 SB8 SB14
RESERVED: SB3 SB5 SB7 SB13
Wired on Solder Side: JP1 JP2

### Ports
MCO, NRST, PA9, PA10, PA13, PA14, PB3

### Nets
3V: C4.2 C27.2 C46.2 C47.2 D3.2(K) JP3.1(COMMON) R3.2 R4.2 R10.2 R18.1 R21.2 SB3.2 U2.1(VBAT) U2.9(VDDA) U2.24(VDD_1) U2.36(VDD_2) U2.48(VDD_3)
5V: C1.2 C2.2 D2.2(K) U1.1(Vin) U1.3(CE)
GND: C1.1 C2.1 C3.1 C4.1 C5.2 C6.1 C9.1 C16.2 C17.2 C18.1 C27.1 C46.1 C47.1 CN1.5(GND) CN1.6(SHELL) CN2.3 JP1.1(COMMON) JP1.2(NO) JP2.1(COMMON) JP2.2(NO) LD1.1 LD2.2 R5.2 R6.1 R7.1 R8.1 R9.2 R19.1 SB7.2 SB10.1 U1.2(GND) U2.8(VSSA) U2.20(PB2/BOOT1) U2.23(VSS_1) U2.35(VSS_2) U2.47(VSS_3)
U5V: CN1.1(VCC) D2.1(A)
VDD: JP3.2(NO)
AIN_1: R13.2 R18.2 R19.2 U2.10(PA0)
LED_STLINK: R1.1 R2.1 U2.30(PA9)
MCO: C18.2 R28.2 ; port MCO
NRST: SB12.2 ; port NRST
OSC_IN: C16.1 U2.5(OSCIN) X1.2(OSC2)
OSC_OUT: C17.1 U2.6(OSCOUT) X1.1(OSC1)
PA9: SB11.1 ; port PA9
PA10: SB15.1 ; port PA10
PA13: SB14.1 ; port PA13
PA14: SB6.1 ; port PA14
PB3: SB9.2 ; port PB3
STLINK_RX: JP4.1(COMMON) SB11.2 U2.13(PA3)
STLINK_TX: JP4.2(NO) SB15.2 U2.12(PA2)
STM_JTCK: SB5.2 U2.37(JTCK/SWCLK)
STM_JTMS: SB13.2 U2.34(JTMS/SWDIO)
STM_RST: C9.2 R21.1 SB10.2 U2.7(NRST)
SWIM: U2.22(PB11) U2.45(PB8)
SWIM_IN: U2.21(PB10) U2.43(PB7) U2.46(PB9)
SWIM_RST: U2.42(PB6)
SWIM_RST_IN: U2.41(PB5)
T_JTCK: R14.2 SB4.1 U2.15(PA5) U2.26(PB13)
T_JTDI: U2.17(PA7)
T_JTDO: U2.16(PA6)
T_JTMS: R15.2 R16.2 SB8.1 U2.27(PB14)
T_NRST: R17.2 SB12.1 U2.18(PB0)
T_SWDIO_IN: R16.1 U2.25(PB12)
T_SWO: R20.2 SB9.1 U2.31(PA10)
USB_DM: R12.2 U2.32(PA11)
USB_DP: R11.2 U2.33(PA12)
NetC3_2: C3.2 U1.4(BYPASS)
NetC5_1: C5.1 C6.2 D3.1(A) U1.5(Vout)
NetCN1_2: CN1.2(D-) R12.1
NetCN1_3: CN1.3(D+) R10.1 R11.1
NetCN1_4: CN1.4(ID) R9.1
NetCN2_1: CN2.1 D1.1(A) R5.1
NetCN2_2: CN2.2 R14.1
NetCN2_4: CN2.4 R15.1
NetCN2_5: CN2.5 R17.1
NetCN2_6: CN2.6 R20.1
NetCN4_1: CN4.1 SB3.1 SB4.2
NetCN4_2: CN4.2 SB5.1 SB6.2
NetCN4_3: CN4.3 SB7.1 SB8.2
NetCN4_4: CN4.4 SB13.1 SB14.2
NetD1_2: D1.2(K) R13.1
NetLD1_2: LD1.2 R2.2
NetLD1_3: LD1.3 R1.2
NetLD1_4: LD1.4 R3.1
NetLD2_1: LD2.1 R4.1
NetR6_2: R6.2 U2.3(PC14)
NetR7_2: R7.2 U2.2(PC13)
NetR8_2: R8.2 U2.44(BOOT0)
NetR28_1: R28.1 U2.29(PA8)

Not connected (* = marked no-connect by the designer): U2 4(PC15)* 11(PA1)* 14(PA4)* 19(PB1)* 28(PB15)* 38(PA15/JTDI)* 39(PB3/JTDO)* 40(PB4/JNTRST)*

### Notes on the sheet
- TCK/SWCLK
- (near SB9) TMS/SWDIO
- SWD
- Board Ident: PC13=0
- Not Fitted
- SWCLK
- SWDIO
- (near R28) RC Must be very close to STM32F103 pin 29
- Jumpers ON  --> DISCOVERY Selected
  Jumpers OFF --> ST-LINK Selected
- STM32F4_USART1_RX
- TX
- (near JP3) Idd
- COM
- STM32F4_USART1_TX
- RX
- (near U2) T_JRST
- (near U1) PWR
- USB ST-LINK
- (near D2) EXT_5V, Input only
- EXT_3V, Input only
- STM32F429I-DISC1 ST-LINK/V2-B (SWD only)
- MB1075
- STMicroelectronics
- Title:
- Number:
- Rev:
- Date:
- Sheet       of
- (in symbol LD3985M33R) INH
- (in symbol LD_BICOLOR_CMS) Red; _Green

### Library data of the parts
C1 C4 C6 C9 C27 C46 C47 = Capacitor_ST: Capacitor 0402 / 0603 / 0805; Revision: July-2002: Re-released for DXP Platform.; Value: 100nF
C2 C5 = CAP SMD 0603  X5R 1µF 25V 10%: 0603  X5R 1µF; Rated voltage: 25V; Tolerance: 10%; Manufacturer: *; Manufacturer P/N: *; Order code Farnell: 1288202RL; Value: 1µF; Power: *; Technology: X5R; Temperature  Factor: *; Temperature Max: +125°C; Temperature Min: -55°C; STS Code: *
C3 = CAP SMD 0603  X7R 10000PF 50V 10%: 0603  X7R 10NF; Order code RS: 2040779; Rated voltage: 50V; Tolerance: 10%; Order code Farnell: 7569548RL; Value: 10NF; Power: *; Technology: X7R; Temperature Factor: *; Temperature Min: -55°C; Temperature Max: +125°C; STS Code: *
C16 C17 = Capacitor_ST: as C20 on sheet STM32Fx; Revision: July-2002: Re-released for DXP Platform.
C18 = Capacitor_ST: as C23 on sheet STM32Fx; Revision: July-2002: Re-released for DXP Platform.
CN1 = USB-MINI-typeB connector: Manuf_Part_1: 5075BMR-05-SM; Manuf_Part_2: 218205M1110T; Manuf_2: lyconn; Description: USB,MINI-USB-5P/F, 5075BMR-05-M; Order: 5075BMR-05-SM
CN2 = Header 6: Header, 6-Pin; LatestRevisionDate: 17-Jul-2002; LatestRevisionNote: Re-released for DXP Platform.; Publisher: Altium Limited
CN4 = Header 4: Header, 4-Pin; Revision: 17-Jul-2002: Re-released for DXP Platform.; Publisher: Altium Limited
D1-D3 = BAT60JFILM: Manuf_1: STM; Provided: ST; ECCN_US/EU: EAR99/NEC; Revision: July-2002: Re-released for DXP Platform.; Order: BAT60JFILM; Manuf_Part_1: BAT60JFILM; Distrib: ST
JP1-JP3 = JP2
JP4 = JP2: Fitted: NO
LD1 = LD_BICOLOR_CMS: Bicolor Led; Manuf_Part_1: HSMF-A201-A00J1; Manuf_1: Avago Technologies; Manuf_2: everluck; Manuf_Part_2: LE-RGW35280; Ref St: xxxxxx; Distrib: RADIOSPARES
LD2 = LED_red: LED, red, 0603; Manuf_1: everlight; Manuf_Part_1: 19-213-R6C-AP1Q2B/3T; Description: LED,red,0603,19-213-R6C-AP1Q2B/3T,everlight; Order: 19-213-R6C-AP1Q2B/3T
R1-R4 R8-R12 R14-R21 R28 = Resistor_ST: as R22 on sheet IO Peripherals
R5 R7 = Resistor_ST: as R71 on sheet USB_OTG_FS; Value: 10K
R6 = Resistor_ST: Resistor 0402 / 0603 / 0805; Description: Resistor 0402 or 0603 or 0805; Fitted: NO; Value: 10K
R13 = Resistor_ST: as R53 on sheet STM32Fx
SB3 SB5 SB7 SB11-SB13 SB15 = Circuit Breaker: Solder: YES; Published: 24-Mar-1999; Revision: July-2002: Re-released for DXP Platform.; Publisher: Altium Limited
SB4 SB6 SB8-SB10 SB14 = Circuit Breaker: Solder: NO; Published: 24-Mar-1999; Revision: July-2002: Re-released for DXP Platform.; Publisher: Altium Limited
U1 = LD3985M33R: Ultra low drop-low noise BiCMOS voltage, regulators low ESR capacitors compatible; Manuf_1: STM; Provided: ST; Ref St: 9176161; ECCN_US/EU: EAR99/NEC; Manuf_Part_1: LD3985M33R; Distrib: ST; Order: LD3985M33R
U2 = STM32F103CBT6: Medium-density performance line ARM-based 32-bit MCU with 128KB Flash; Manuf_1: STM; Ref St: xxxxxxxx; Provided: ST; ECCN_US/EU: 3A991A2/NEC; Footprint: QFP48 7X7; Manuf_Part_1: STM32F103CBT6; Order: STM32F103CBT6; Distrib: ST
X1 = XTAL: as X3 on sheet STM32Fx; Order: 9SL8000020AFXHF0

## Nets that join several sheets
3V: MB1075 (P2.1 P2.2), SDRAM (14 pins), IO Peripherals (6 pins), USB_OTG_FS (R68.2 R70.2 R71.2 R73.2), ST_LINK_V2 (17 pins)
5V: MB1075 (P1.1 P1.2), IO Peripherals (CN3.8), USB_OTG_FS (U8.5), ST_LINK_V2 (5 pins)
GND: MB1075 (6 pins), SDRAM (14 pins), IO Peripherals (16 pins), STM32Fx (35 pins), USB_OTG_FS (7 pins), ST_LINK_V2 (36 pins)
VDD: MB1075 (P1.22), IO Peripherals (B1.1 B1.4 R24.2 R25.2), STM32Fx (29 pins), ST_LINK_V2 (JP3.2)
A0: MB1075 (P1.7), SDRAM (U6.23), STM32Fx (U5.10)
A1: MB1075 (P1.8), SDRAM (U6.24), STM32Fx (U5.11)
A2: MB1075 (P1.5), SDRAM (U6.25), STM32Fx (U5.12)
A3: MB1075 (P1.6), SDRAM (U6.26), STM32Fx (U5.13)
A4: MB1075 (P1.3), SDRAM (U6.29), STM32Fx (U5.14)
A5: MB1075 (P1.4), SDRAM (U6.30), STM32Fx (U5.15)
A6: MB1075 (P2.31), SDRAM (U6.31), STM32Fx (U5.50)
A7: MB1075 (P2.34), SDRAM (U6.32), STM32Fx (U5.53)
A8: MB1075 (P2.33), SDRAM (U6.33), STM32Fx (U5.54)
A9: MB1075 (P2.36), SDRAM (U6.34), STM32Fx (U5.55)
A10: MB1075 (P2.35), SDRAM (U6.22), STM32Fx (U5.56)
A11: MB1075 (P2.38), SDRAM (U6.35), STM32Fx (U5.57)
ACP_RST: MB1075 (P2.23), IO Peripherals (CN3.4), STM32Fx (U5.43)
B2: MB1075 (P1.36), STM32Fx (U5.122)
B3: MB1075 (P1.31), STM32Fx (U5.126)
B4: MB1075 (P1.32), STM32Fx (U5.127)
B5: MB1075 (P2.19), STM32Fx (U5.37)
B6: MB1075 (P1.19), STM32Fx (U5.139)
B7: MB1075 (P1.20), STM32Fx (U5.140)
BA0: MB1075 (P1.62), SDRAM (U6.20), STM32Fx (U5.89)
BA1: MB1075 (P1.61), SDRAM (U6.21), STM32Fx (U5.90)
BOOT0: MB1075 (P1.21), STM32Fx (R59.2 R61.2 U5.138)
CSX: MB1075 (P2.16), STM32Fx (U5.28)
D0: MB1075 (P2.60), SDRAM (U6.2), STM32Fx (U5.85)
D1: MB1075 (P2.59), SDRAM (U6.4), STM32Fx (U5.86)
D2: MB1075 (P1.42), SDRAM (U6.5), STM32Fx (U5.114)
D3: MB1075 (P1.41), SDRAM (U6.7), STM32Fx (U5.115)
D4: MB1075 (P2.37), SDRAM (U6.8), STM32Fx (U5.58)
D5: MB1075 (P2.40), SDRAM (U6.10), STM32Fx (U5.59)
D6: MB1075 (P2.39), SDRAM (U6.11), STM32Fx (U5.60)
D7: MB1075 (P2.42), SDRAM (U6.13), STM32Fx (U5.63)
D8: MB1075 (P2.41), SDRAM (U6.42), STM32Fx (U5.64)
D9: MB1075 (P2.44), SDRAM (U6.44), STM32Fx (U5.65)
D10: MB1075 (P2.43), SDRAM (U6.45), STM32Fx (U5.66)
D11: MB1075 (P2.46), SDRAM (U6.47), STM32Fx (U5.67)
D12: MB1075 (P2.45), SDRAM (U6.48), STM32Fx (U5.68)
D13: MB1075 (P2.54), SDRAM (U6.50), STM32Fx (U5.77)
D14: MB1075 (P2.53), SDRAM (U6.51), STM32Fx (U5.78)
D15: MB1075 (P2.56), SDRAM (U6.53), STM32Fx (U5.79)
DCX_SCL: MB1075 (P2.6), IO Peripherals (U3.2), STM32Fx (U5.19)
DOTCLK: MB1075 (P1.59), STM32Fx (U5.92)
ENABLE: MB1075 (P2.7), STM32Fx (U5.22)
G2: MB1075 (P2.24), STM32Fx (U5.42)
G3: MB1075 (P1.34), STM32Fx (U5.125)
G4: MB1075 (P2.48), STM32Fx (U5.69)
G5: MB1075 (P2.47), STM32Fx (U5.70)
G6: MB1075 (P1.56), STM32Fx (U5.97)
G7: MB1075 (P1.39), STM32Fx (U5.117)
HSYNC: MB1075 (P1.57), STM32Fx (U5.96)
I2C3_SCL: MB1075 (P1.53), IO Peripherals (CN3.3), STM32Fx (U5.100)
I2C3_SDA: MB1075 (P1.54), IO Peripherals (CN3.1), STM32Fx (U5.99)
MCO: STM32Fx (SB18.1), ST_LINK_V2 (C18.2 R28.2)
MEMS_INT1: MB1075 (P2.17), IO Peripherals (U3.7), STM32Fx (U5.35)
MEMS_INT2: MB1075 (P2.20), IO Peripherals (U3.6), STM32Fx (U5.36)
NBL0: MB1075 (P1.17), SDRAM (U6.15), STM32Fx (U5.141)
NBL1: MB1075 (P1.18), SDRAM (U6.39), STM32Fx (U5.142)
NCS_MEMS_SPI: MB1075 (P2.13), IO Peripherals (U3.5), STM32Fx (U5.27)
NRST: MB1075 (P2.12), IO Peripherals (SB1.1), STM32Fx (U5.25), ST_LINK_V2 (SB12.2)
OTG_FS_DM: MB1075 (SB27.2), STM32Fx (U5.75), USB_OTG_FS (R64.1 U7.D3)
OTG_FS_DP: MB1075 (SB26.1), STM32Fx (U5.76), USB_OTG_FS (R63.1 U7.C3)
OTG_FS_ID: MB1075 (P2.50), STM32Fx (U5.73), USB_OTG_FS (R67.1)
OTG_FS_OC: MB1075 (P2.25), STM32Fx (U5.45), USB_OTG_FS (R69.2)
OTG_FS_PSO: MB1075 (P2.26), STM32Fx (U5.44), USB_OTG_FS (R72.1)
PA0: MB1075 (P2.18), IO Peripherals (SB2.1), STM32Fx (U5.34)
PA4: MB1075 (P2.22), STM32Fx (U5.40)
PA5: MB1075 (P2.21), STM32Fx (U5.41)
PA9: MB1075 (P1.52), STM32Fx (U5.101), ST_LINK_V2 (SB11.1)
PA10: MB1075 (P1.51), STM32Fx (U5.102), ST_LINK_V2 (SB15.1)
PA11: MB1075 (P1.50), STM32Fx (U5.103)
PA12: MB1075 (P1.49), STM32Fx (U5.104)
PA13: MB1075 (P1.48), STM32Fx (U5.105), ST_LINK_V2 (SB14.1)
PA14: MB1075 (P1.47), STM32Fx (U5.109), ST_LINK_V2 (SB6.1)
PA15: MB1075 (P1.46), STM32Fx (U5.110)
PB0: MB1075 (P2.28), STM32Fx (U5.46)
PB1: MB1075 (P2.27), STM32Fx (U5.47)
PB2: MB1075 (P2.30), STM32Fx (U5.48)
PB3: MB1075 (P1.28), STM32Fx (U5.133), ST_LINK_V2 (SB9.2)
PB4: MB1075 (P1.25), STM32Fx (U5.134)
PB5: MB1075 (P1.26), SDRAM (U6.37), STM32Fx (U5.135)
PB6: MB1075 (P1.23), SDRAM (U6.19), STM32Fx (U5.136)
PB7: MB1075 (P1.24), STM32Fx (U5.137)
PB13: MB1075 (P2.49), STM32Fx (U5.74), USB_OTG_FS (5 pins)
PC0: MB1075 (P2.14), SDRAM (U6.16), STM32Fx (U5.26)
PC3: MB1075 (P2.15), STM32Fx (U5.29)
PC8: MB1075 (P1.55), STM32Fx (U5.98)
PC10: MB1075 (P1.45), STM32Fx (U5.111)
PC11: MB1075 (P1.44), STM32Fx (U5.112)
PC12: MB1075 (P1.43), STM32Fx (U5.113)
PC13: MB1075 (P1.12), STM32Fx (U5.7)
PC14: MB1075 (P1.9), STM32Fx (SB16.1)
PC15: MB1075 (P1.10), STM32Fx (SB17.1)
PD2: MB1075 (P1.40), STM32Fx (SB25.1 U5.116)
PD4: MB1075 (P1.38), STM32Fx (SB24.1 U5.118)
PD5: MB1075 (P1.37), STM32Fx (SB23.1 U5.119)
PD7: MB1075 (P1.35), STM32Fx (SB22.1 U5.123)
PD11: MB1075 (P2.55), STM32Fx (U5.80)
PD12: MB1075 (P2.58), STM32Fx (U5.81)
PD13: MB1075 (P2.57), STM32Fx (U5.82)
PE2: MB1075 (P1.15), STM32Fx (U5.1)
PE3: MB1075 (P1.16), STM32Fx (U5.2)
PE4: MB1075 (P1.13), STM32Fx (U5.3)
PE5: MB1075 (P1.14), STM32Fx (U5.4)
PE6: MB1075 (P1.11), STM32Fx (U5.5)
PF6: MB1075 (P2.3), STM32Fx (U5.18)
PF8: MB1075 (P2.5), IO Peripherals (U3.4), STM32Fx (U5.20)
PF9: MB1075 (P2.8), IO Peripherals (U3.3), STM32Fx (U5.21)
PF11: MB1075 (P2.32), SDRAM (U6.18), STM32Fx (U5.49)
PG2: MB1075 (P2.62), STM32Fx (U5.87)
PG3: MB1075 (P2.61), STM32Fx (U5.88)
PG6: MB1075 (P1.60), STM32Fx (U5.91)
PG8: MB1075 (P1.58), SDRAM (U6.38), STM32Fx (U5.93)
PG9: MB1075 (P1.33), STM32Fx (U5.124)
PG13: MB1075 (P1.29), IO Peripherals (R26.1), STM32Fx (U5.128)
PG14: MB1075 (P1.30), IO Peripherals (R27.1), STM32Fx (U5.129)
PG15: MB1075 (P1.27), SDRAM (U6.17), STM32Fx (U5.132)
PH0: MB1075 (P2.10), STM32Fx (SB19.1)
PH1: MB1075 (P2.9), STM32Fx (SB20.1)